# Altium project DM3390_R0M0E0.PrjPcb (part 1 of 5)
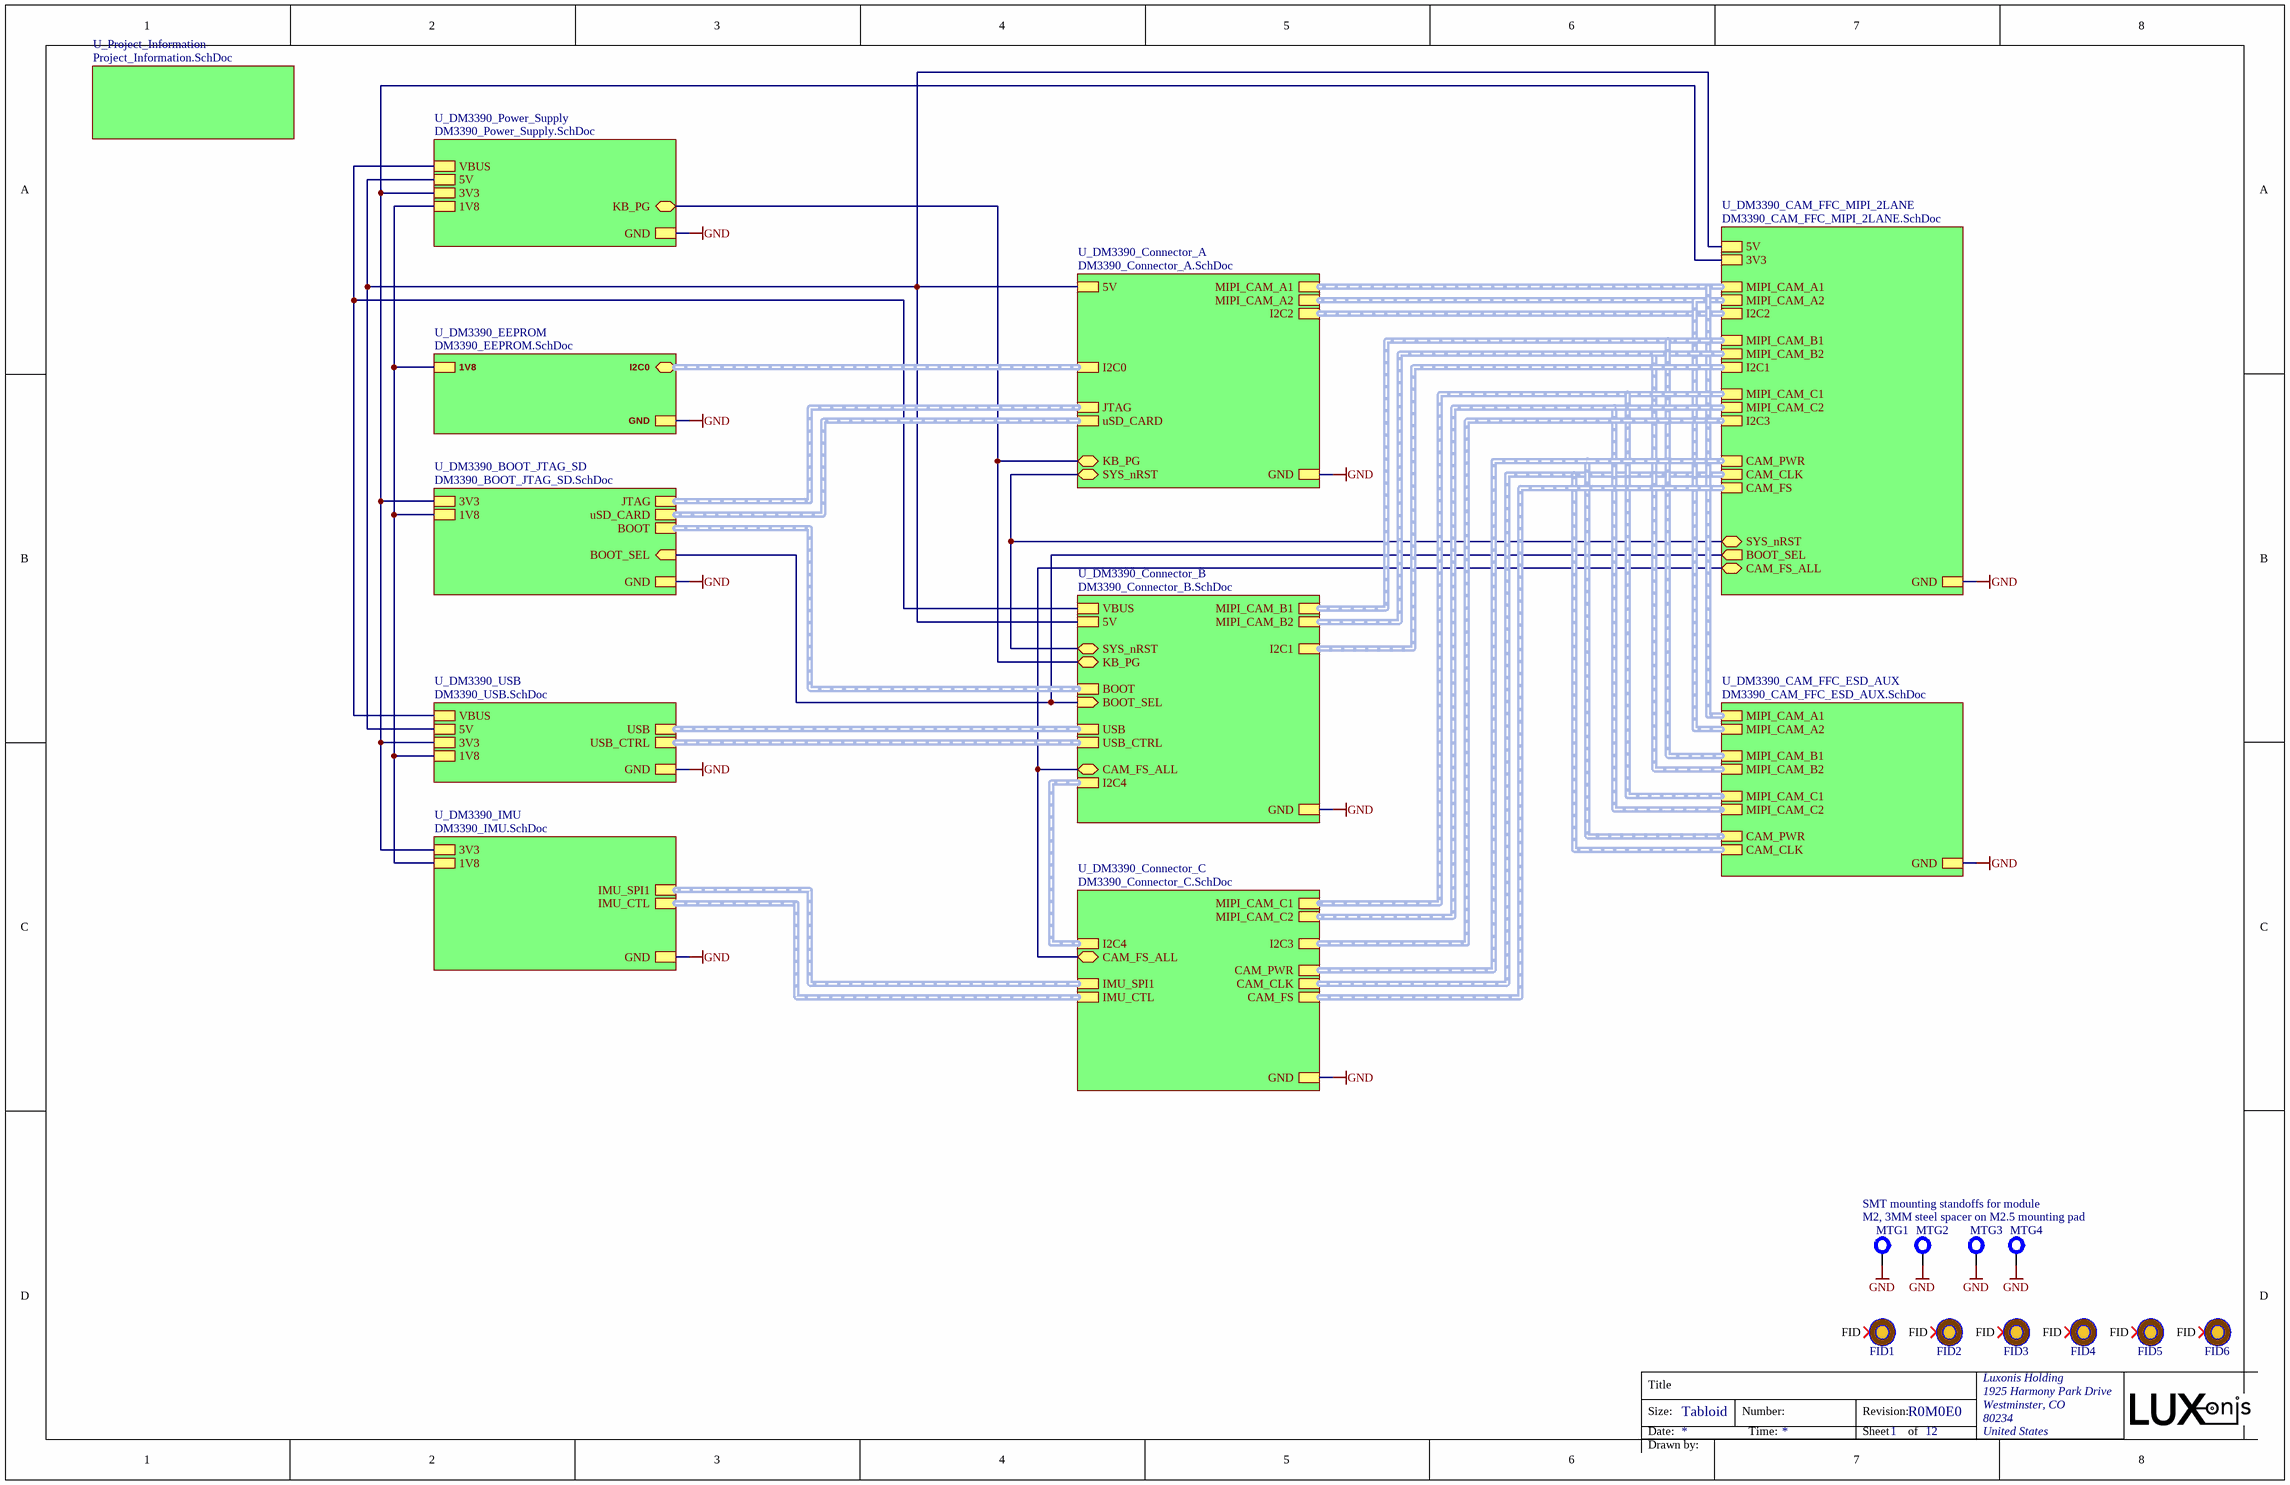
[diagram p0: DM3390_TopLevel.SchDoc]
document_number: D0000190; drawn_by: David Malovrh; project_title: DM3390; rev: R0M0E0
12 sheets, 186 parts. Net scope: strictly hierarchical (ports join the sheet entries above them; power ports are local).
Board file: DM3390.PcbDoc
Sheets:
  DM3390_TopLevel.SchDoc
    U_DM3390_USB = DM3390_USB.SchDoc
    U_Project_Information = Project_Information.SchDoc
    U_DM3390_Power_Supply = DM3390_Power_Supply.SchDoc
    U_DM3390_IMU = DM3390_IMU.SchDoc
    U_DM3390_BOOT_JTAG_SD = DM3390_BOOT_JTAG_SD.SchDoc
    U_DM3390_CAM_FFC_ESD_AUX = DM3390_CAM_FFC_ESD_AUX.SchDoc
    U_DM3390_CAM_FFC_MIPI_2LANE = DM3390_CAM_FFC_MIPI_2LANE.SchDoc
    U_DM3390_Connector_A = DM3390_Connector_A.SchDoc
    U_DM3390_Connector_B = DM3390_Connector_B.SchDoc
    U_DM3390_EEPROM = DM3390_EEPROM.SchDoc
    U_DM3390_Connector_C = DM3390_Connector_C.SchDoc

## Sheet DM3390_TopLevel.SchDoc: =project_title
size Tabloid; PageSetup: Record=PageOptions|CenterHorizontal=True|CenterVertical=True|PrintScale=0.73|XCorrection=1.00|YCorrection=1.00|PrintKind=0|BorderSize=5000000|LeftOffset=0|BottomOffset=0|Orientation=2|PaperLength=1000|PaperWidth=1000|Scale=100|PaperSource=7|PrintQuality=-4|MediaType=1|DitherType=10|PaperKind=A4|PrintScaleMode=1; CompanyName: Luxonis Holding; DrawnBy: David Malovrh; Organization: Luxonis Holding; Address1: 1925 Harmony Park Drive; Address2: Westminster, CO; Address3: 80234; Address4: United States; DocumentNumber: D0000190; SheetNumber: 1; SheetTotal: 12

### Parts
FID1  FIDUCIAL_ROUND_1MM  [FIDUCIAL_ROUND_1MM]  (value not drawn)  (no BOM)
FID2  FIDUCIAL_ROUND_1MM  [FIDUCIAL_ROUND_1MM]  (value not drawn)  (no BOM)
FID3  FIDUCIAL_ROUND_1MM  [FIDUCIAL_ROUND_1MM]  (value not drawn)  (no BOM)
FID4  FIDUCIAL_ROUND_1MM  [FIDUCIAL_ROUND_1MM]  (value not drawn)  (no BOM)
FID5  FIDUCIAL_ROUND_1MM  [FIDUCIAL_ROUND_1MM]  (value not drawn)  (no BOM)
FID6  FIDUCIAL_ROUND_1MM  [FIDUCIAL_ROUND_1MM]  (value not drawn)  (no BOM)
MTG1  M2, 3MM steel spacer on M2.5 mounting pad  [9774030243R]
MTG2  M2, 3MM steel spacer on M2.5 mounting pad  [9774030243R]  (value not drawn)
MTG3  M2, 3MM steel spacer on M2.5 mounting pad  [9774030243R]  (value not drawn)
MTG4  M2, 3MM steel spacer on M2.5 mounting pad  [9774030243R]  (value not drawn)

### Sub-sheets
U_DM3390_BOOT_JTAG_SD = DM3390_BOOT_JTAG_SD.SchDoc: 1V8, GND, 3V3, JTAG (harness JTAG), BOOT (harness BOOT), uSD_CARD (harness uSD_CARD), BOOT_SEL (in)
U_DM3390_CAM_FFC_ESD_AUX = DM3390_CAM_FFC_ESD_AUX.SchDoc: MIPI_CAM_C1 (harness MIPI_CAM_C1), MIPI_CAM_C2 (harness MIPI_CAM_C2), MIPI_CAM_B1 (harness MIPI_CAM_B1), MIPI_CAM_A1 (harness MIPI_CAM_A1), MIPI_CAM_A2 (harness MIPI_CAM_A2), CAM_PWR (harness CAM_PWR), MIPI_CAM_B2 (harness MIPI_CAM_B2), CAM_CLK (harness CAM_CLK), GND
U_DM3390_CAM_FFC_MIPI_2LANE = DM3390_CAM_FFC_MIPI_2LANE.SchDoc: I2C1 (harness I2C1), GND, 3V3, CAM_FS_ALL (bidir), MIPI_CAM_C1 (harness MIPI_CAM_C1), MIPI_CAM_C2 (harness MIPI_CAM_C2), I2C3 (harness I2C3), MIPI_CAM_B2 (harness MIPI_CAM_B2), MIPI_CAM_B1 (harness MIPI_CAM_B1), CAM_CLK (harness CAM_CLK), CAM_PWR (harness CAM_PWR), MIPI_CAM_A2 (harness MIPI_CAM_A2), MIPI_CAM_A1 (harness MIPI_CAM_A1), I2C2 (harness I2C2), CAM_FS (harness CAM_FS), SYS_nRST (bidir), BOOT_SEL (out), 5V
U_DM3390_Connector_A = DM3390_Connector_A.SchDoc: 5V, GND, MIPI_CAM_A1 (harness MIPI_CAM_A1), MIPI_CAM_A2 (harness MIPI_CAM_A2), I2C0 (harness I2C0), JTAG (harness JTAG), I2C2 (harness I2C2), KB_PG (bidir), uSD_CARD (harness uSD_CARD), SYS_nRST (bidir)
U_DM3390_Connector_B = DM3390_Connector_B.SchDoc: MIPI_CAM_B2 (harness MIPI_CAM_B2), GND, MIPI_CAM_B1 (harness MIPI_CAM_B1), USB (harness USB), I2C4 (harness I2C4), CAM_FS_ALL (bidir), I2C1 (harness I2C1), BOOT_SEL (in), KB_PG (bidir), USB_CTRL (harness USB_CTRL), SYS_nRST (bidir), BOOT, VBUS, 5V
U_DM3390_Connector_C = DM3390_Connector_C.SchDoc: MIPI_CAM_C1 (harness MIPI_CAM_C1), GND, MIPI_CAM_C2 (harness MIPI_CAM_C2), I2C4 (harness I2C4), IMU_SPI1 (harness IMU_SPI1), CAM_PWR (harness CAM_PWR), CAM_CLK (harness CAM_CLK), CAM_FS (harness CAM_FS), CAM_FS_ALL (bidir), IMU_CTL (harness IMU_CTL), I2C3 (harness I2C3)
U_DM3390_EEPROM = DM3390_EEPROM.SchDoc: 1V8, GND, I2C0 (bidir, harness I2C0)
U_DM3390_IMU = DM3390_IMU.SchDoc: GND, 3V3, 1V8, IMU_SPI1 (harness IMU_SPI1), IMU_CTL (harness IMU_CTL)
U_DM3390_Power_Supply = DM3390_Power_Supply.SchDoc: GND, 1V8, 5V, VBUS, 3V3, KB_PG (bidir)
U_DM3390_USB = DM3390_USB.SchDoc: VBUS, GND, 3V3, 5V, USB (harness USB), USB_CTRL (harness USB_CTRL), 1V8
U_Project_Information = Project_Information.SchDoc: no entries

### Nets
1V8: sheet U_DM3390_USB/1V8, sheet U_DM3390_Power_Supply/1V8, sheet U_DM3390_IMU/1V8, sheet U_DM3390_BOOT_JTAG_SD/1V8, sheet U_DM3390_EEPROM/1V8
3V3: sheet U_DM3390_USB/3V3, sheet U_DM3390_Power_Supply/3V3, sheet U_DM3390_IMU/3V3, sheet U_DM3390_BOOT_JTAG_SD/3V3, sheet U_DM3390_CAM_FFC_MIPI_2LANE/3V3
5V: sheet U_DM3390_USB/5V, sheet U_DM3390_Power_Supply/5V, sheet U_DM3390_CAM_FFC_MIPI_2LANE/5V, sheet U_DM3390_Connector_A/5V, sheet U_DM3390_Connector_B/5V
GND: MTG1.1 MTG2.1 MTG3.1 MTG4.1 ; sheet U_DM3390_USB/GND, sheet U_DM3390_Power_Supply/GND, sheet U_DM3390_IMU/GND, sheet U_DM3390_BOOT_JTAG_SD/GND, sheet U_DM3390_CAM_FFC_ESD_AUX/GND, sheet U_DM3390_CAM_FFC_MIPI_2LANE/GND, sheet U_DM3390_Connector_A/GND, sheet U_DM3390_Connector_B/GND, sheet U_DM3390_EEPROM/GND, sheet U_DM3390_Connector_C/GND
VBUS: sheet U_DM3390_USB/VBUS, sheet U_DM3390_Power_Supply/VBUS, sheet U_DM3390_Connector_B/VBUS
BOOT_SEL: sheet U_DM3390_BOOT_JTAG_SD/BOOT_SEL, sheet U_DM3390_CAM_FFC_MIPI_2LANE/BOOT_SEL, sheet U_DM3390_Connector_B/BOOT_SEL
CAM_FS_ALL: sheet U_DM3390_CAM_FFC_MIPI_2LANE/CAM_FS_ALL, sheet U_DM3390_Connector_B/CAM_FS_ALL, sheet U_DM3390_Connector_C/CAM_FS_ALL
KB_PG: sheet U_DM3390_Power_Supply/KB_PG, sheet U_DM3390_Connector_A/KB_PG, sheet U_DM3390_Connector_B/KB_PG
SYS_nRST: sheet U_DM3390_CAM_FFC_MIPI_2LANE/SYS_nRST, sheet U_DM3390_Connector_A/SYS_nRST, sheet U_DM3390_Connector_B/SYS_nRST

Not connected (* = marked no-connect by the designer): FID1 FID*; FID2 FID*; FID3 FID*; FID4 FID*; FID5 FID*; FID6 FID*

### Buses and harness runs
harness sheet U_DM3390_BOOT_JTAG_SD/BOOT = sheet U_DM3390_Connector_B/BOOT
harness sheet U_DM3390_BOOT_JTAG_SD/JTAG = sheet U_DM3390_Connector_A/JTAG
harness sheet U_DM3390_BOOT_JTAG_SD/uSD_CARD = sheet U_DM3390_Connector_A/uSD_CARD
harness sheet U_DM3390_CAM_FFC_ESD_AUX/CAM_CLK = sheet U_DM3390_CAM_FFC_MIPI_2LANE/CAM_CLK = sheet U_DM3390_Connector_C/CAM_CLK
harness sheet U_DM3390_CAM_FFC_ESD_AUX/CAM_PWR = sheet U_DM3390_CAM_FFC_MIPI_2LANE/CAM_PWR = sheet U_DM3390_Connector_C/CAM_PWR
harness sheet U_DM3390_CAM_FFC_ESD_AUX/MIPI_CAM_A1 = sheet U_DM3390_CAM_FFC_MIPI_2LANE/MIPI_CAM_A1 = sheet U_DM3390_Connector_A/MIPI_CAM_A1
harness sheet U_DM3390_CAM_FFC_ESD_AUX/MIPI_CAM_A2 = sheet U_DM3390_CAM_FFC_MIPI_2LANE/MIPI_CAM_A2 = sheet U_DM3390_Connector_A/MIPI_CAM_A2
harness sheet U_DM3390_CAM_FFC_ESD_AUX/MIPI_CAM_B1 = sheet U_DM3390_CAM_FFC_MIPI_2LANE/MIPI_CAM_B1 = sheet U_DM3390_Connector_B/MIPI_CAM_B1
harness sheet U_DM3390_CAM_FFC_ESD_AUX/MIPI_CAM_B2 = sheet U_DM3390_CAM_FFC_MIPI_2LANE/MIPI_CAM_B2 = sheet U_DM3390_Connector_B/MIPI_CAM_B2
harness sheet U_DM3390_CAM_FFC_ESD_AUX/MIPI_CAM_C1 = sheet U_DM3390_CAM_FFC_MIPI_2LANE/MIPI_CAM_C1 = sheet U_DM3390_Connector_C/MIPI_CAM_C1
harness sheet U_DM3390_CAM_FFC_ESD_AUX/MIPI_CAM_C2 = sheet U_DM3390_CAM_FFC_MIPI_2LANE/MIPI_CAM_C2 = sheet U_DM3390_Connector_C/MIPI_CAM_C2
harness sheet U_DM3390_CAM_FFC_MIPI_2LANE/CAM_FS = sheet U_DM3390_Connector_C/CAM_FS
harness sheet U_DM3390_CAM_FFC_MIPI_2LANE/I2C1 = sheet U_DM3390_Connector_B/I2C1
harness sheet U_DM3390_CAM_FFC_MIPI_2LANE/I2C2 = sheet U_DM3390_Connector_A/I2C2
harness sheet U_DM3390_CAM_FFC_MIPI_2LANE/I2C3 = sheet U_DM3390_Connector_C/I2C3
harness sheet U_DM3390_Connector_A/I2C0 = sheet U_DM3390_EEPROM/I2C0
harness sheet U_DM3390_Connector_B/I2C4 = sheet U_DM3390_Connector_C/I2C4
harness sheet U_DM3390_Connector_B/USB = sheet U_DM3390_USB/USB
harness sheet U_DM3390_Connector_B/USB_CTRL = sheet U_DM3390_USB/USB_CTRL
harness sheet U_DM3390_Connector_C/IMU_CTL = sheet U_DM3390_IMU/IMU_CTL
harness sheet U_DM3390_Connector_C/IMU_SPI1 = sheet U_DM3390_IMU/IMU_SPI1

### Notes on the sheet
- SMT mounting standoffs for module
- Title
- Size:
- Date:
- Tabloid
- Number:
- Time:
- Revision:
- Sheet
- of
- Drawn by:

### Library data of the parts
FID1-FID6 = FIDUCIAL: Fiducial with various available footprints
MTG1-MTG4 = 9774030243R: MP ROUND STANDOFF M2X0.4 STEEL 3MM; Manufacturer 1: Wurth Electronics; Plating: Tin; Threaded/Unthreaded: Threaded; Outside Diameter: 0.171inch; Supplier 1: Digi-Key; Manufacturer Part Number 1: 9774030243R; Stock 1: 20568; Pricing 1: 1=0.95000, 10=0.91800, 50=0.79500, 100=0.73900 (USD); RoHS: Yes; Material: Steel; Length: 0.173inch; REACH SVHC: Unknown; ComponentLink1URL: http://www.mouser.com/ds/2/445/9774030243R-611455.pdf?src-supplier=Mouser; ComponentLink1Description: http://www.mouser.com/ds/2/445/9774030243R-611455.pdf?src-supplier=Mouser; ComponentLink2URL: http://www.farnell.com/datasheets/1960368.pdf?src-supplier=Farnell; ComponentLink2Description: http://www.farnell.com/datasheets/1960368.pdf?src-supplier=Farnell; ComponentLink3URL: https://katalog.we-online.de/em/datasheet/9774030243R.pdf?src-supplier=Digi-Key; ComponentLink3Description: https://katalog.we-online.de/em/datasheet/9774030243R.pdf?src-supplier=Digi-Key; ComponentLink4URL: http://www.farnell.com/datasheets/1960368.pdf?src-supplier=Newark; ComponentLink4Description: http://www.farnell.com/datasheets/1960368.pdf?src-supplier=Newark; ComponentLink5URL: http://www.farnell.com/datasheets/1960368.pdf?src-supplier=Element14; ComponentLink5Description: http://www.farnell.com/datasheets/1960368.pdf?src-supplier=Element14; Supplier Part Number 1: 732-7085-1-ND; Supplier 2: Mouser; Supplier Part Number 2: 710-9774030243R; Supplier 3: Element14; Supplier Part Number 3: 2497599

## Sheet DM3390_USB.SchDoc: =project_title
size Tabloid; PageSetup: Record=PageOptions|CenterHorizontal=True|CenterVertical=True|PrintScale=0.73|XCorrection=1.00|YCorrection=1.00|PrintKind=0|BorderSize=5000000|LeftOffset=0|BottomOffset=0|Orientation=2|PaperLength=1000|PaperWidth=1000|Scale=100|PaperSource=7|PrintQuality=-4|MediaType=1|DitherType=10|PaperKind=A4|PrintScaleMode=1; CompanyName: Luxonis Holding; DrawnBy: David Malovrh; Organization: Luxonis Holding; Address1: 1925 Harmony Park Drive; Address2: Westminster, CO; Address3: 80234; Address4: United States; DocumentNumber: D0000190; SheetNumber: 12; SheetTotal: 12
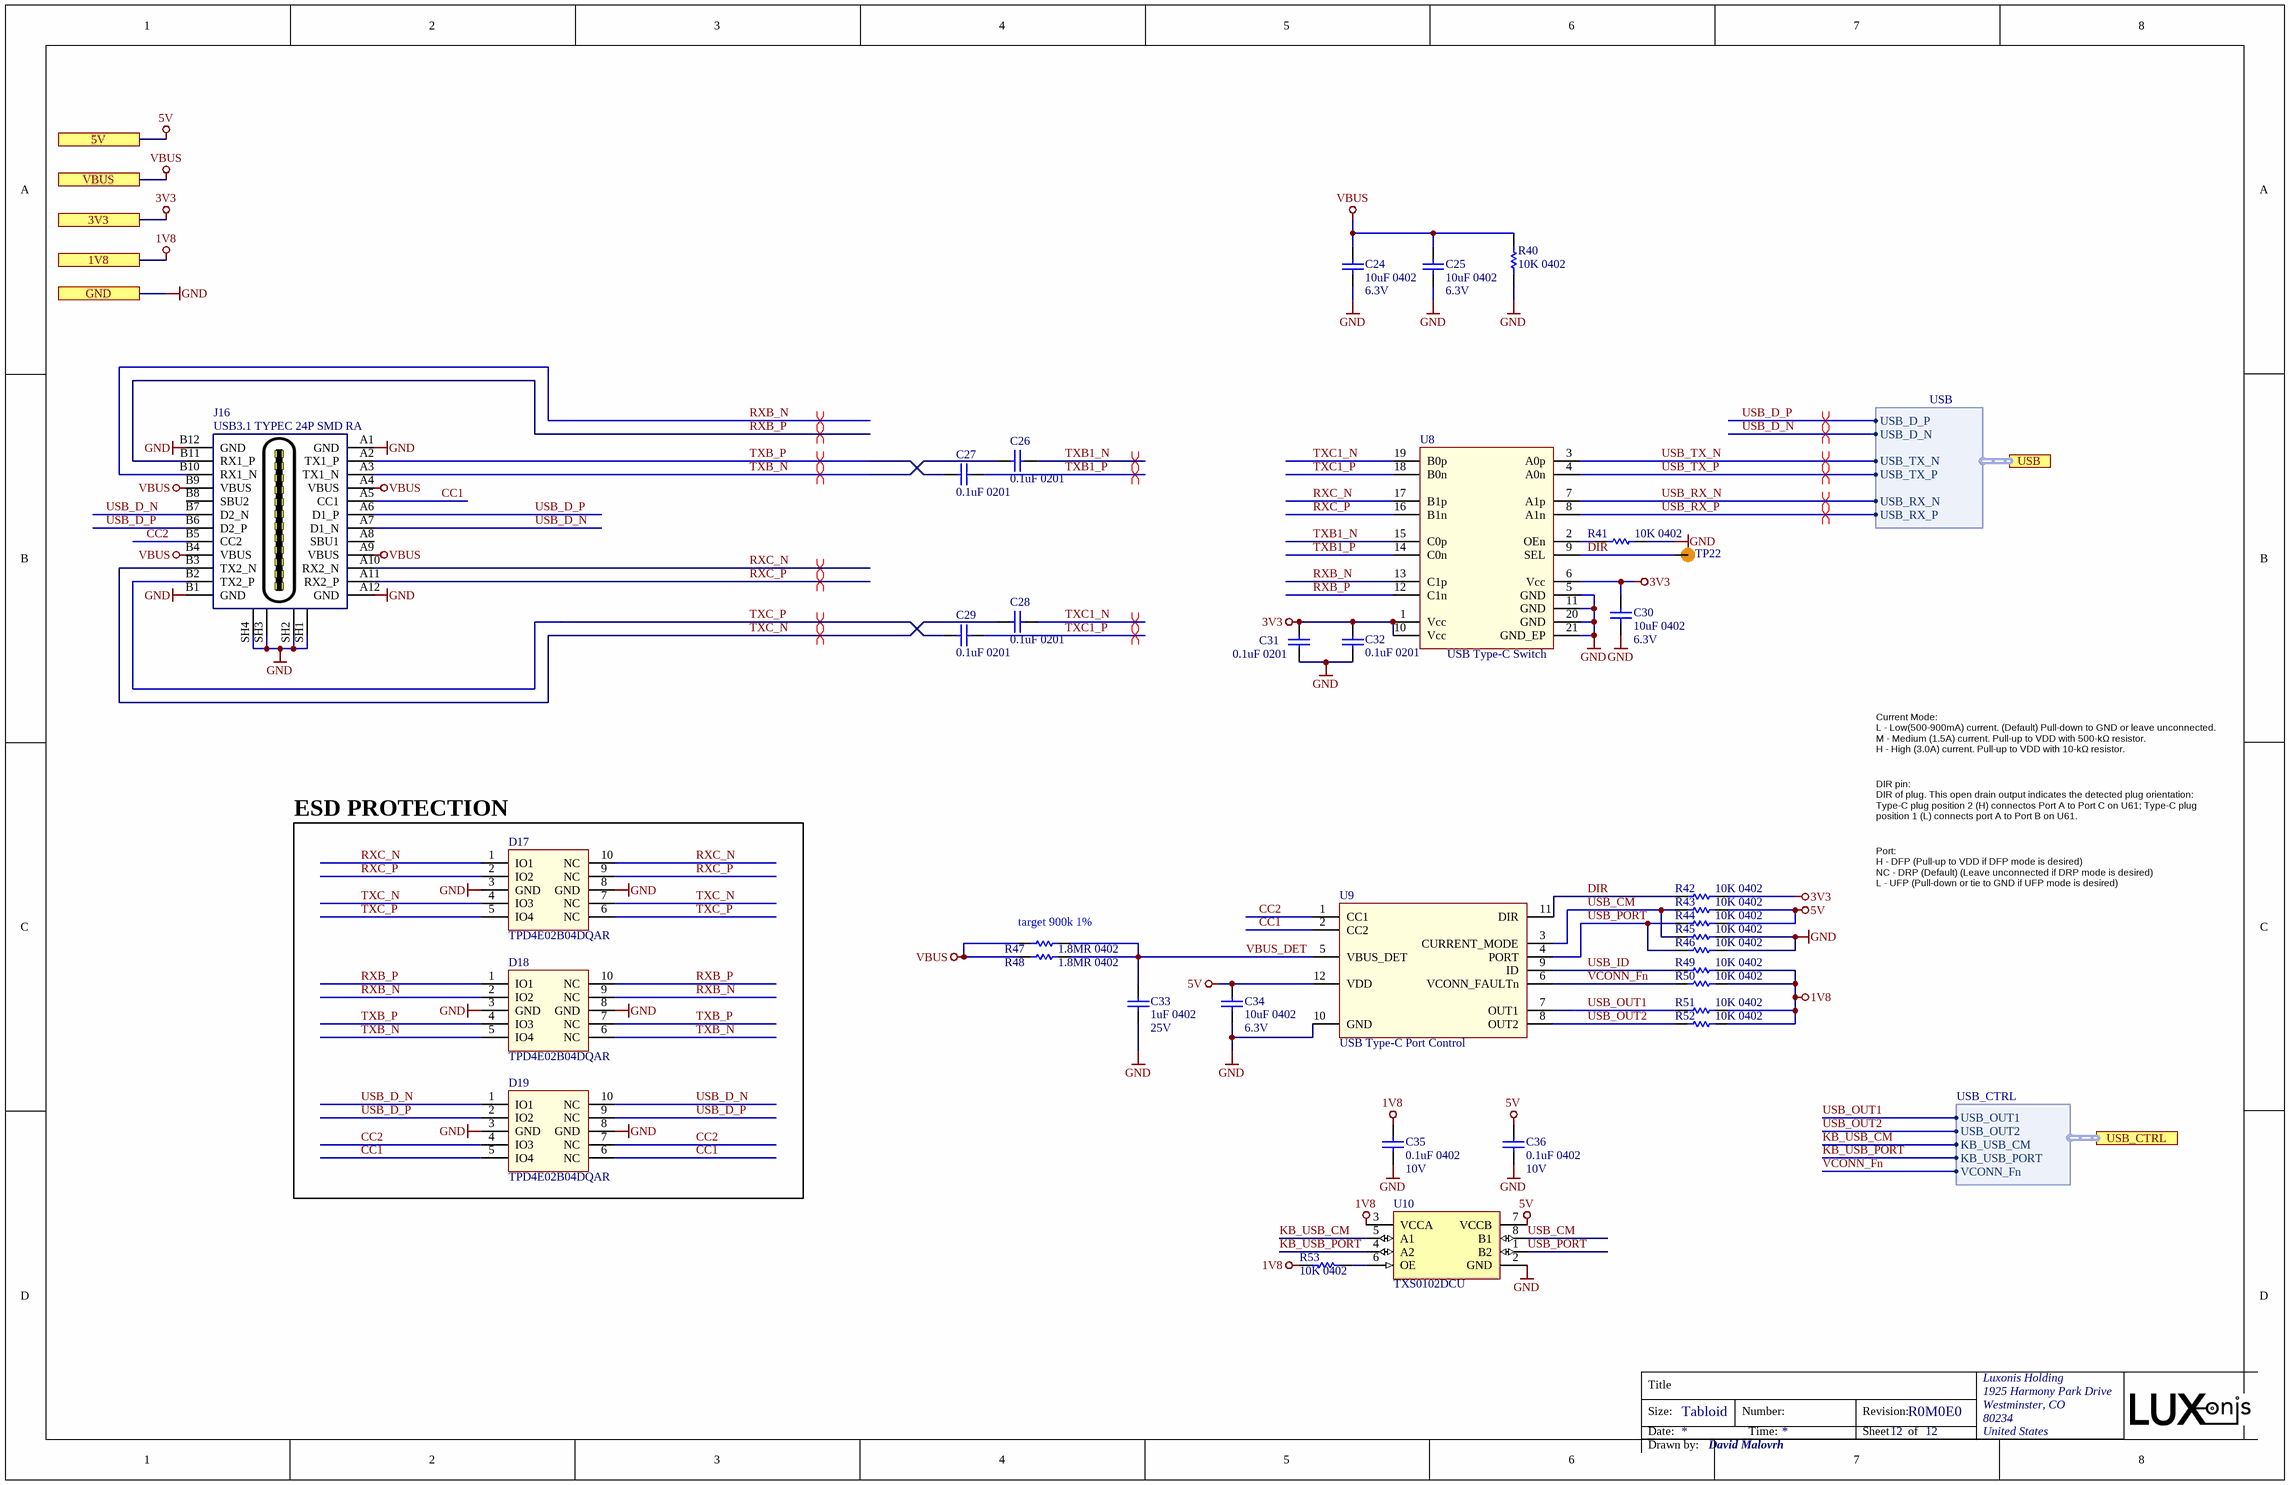
[diagram p1: DM3390_USB.SchDoc]

### Parts
C24  10uF 0402  Voltage Rating: 6.3V  [CAPC0402(1005)70_N]
C25  10uF 0402  Voltage Rating: 6.3V  [CAPC0402(1005)70_N]
C26  0.1uF 0201  [CAPC0201(0603)33_L]
C27  0.1uF 0201  [CAPC0201(0603)33_L]
C28  0.1uF 0201  [CAPC0201(0603)33_L]
C29  0.1uF 0201  [CAPC0201(0603)33_L]
C30  10uF 0402  Voltage Rating: 6.3V  [CAPC0402(1005)70_N]
C31  0.1uF 0201  [CAPC0201(0603)33_L]
C32  0.1uF 0201  [CAPC0201(0603)33_L]
C33  1uF 0402  Voltage Rating: 25V  [CAPC0402(1005)70_L]
C34  10uF 0402  Voltage Rating: 6.3V  [CAPC0402(1005)70_L]
C35  0.1uF 0402  Voltage Rating: 10V  [CAPC0402(1005)70_L]
C36  0.1uF 0402  Voltage Rating: 10V  [CAPC0402(1005)70_L]
D17  TPD4E02B04DQAR  [TPD4E02B04DQAR]
D18  TPD4E02B04DQAR  [TPD4E02B04DQAR]
D19  TPD4E02B04DQAR  [TPD4E02B04DQAR]
J16  USB3.1 TYPEC 24P SMD RA  [105450-0101]
R40  10K 0402  [RESC0402(1005)_N]
R41  10K 0402  [RESC0402(1005)_N]
R42  10K 0402  [RESC0402(1005)_L]
R43  10K 0402  [RESC0402(1005)_L]
R44  10K 0402  [RESC0402(1005)_L]
R45  10K 0402  [RESC0402(1005)_L]
R46  10K 0402  [RESC0402(1005)_L]
R47  1.8MR 0402  [RESC0402(1005)_L]
R48  1.8MR 0402  [RESC0402(1005)_L]
R49  10K 0402  [RESC0402(1005)_L]
R50  10K 0402  [RESC0402(1005)_L]
R51  10K 0402  [RESC0402(1005)_L]
R52  10K 0402  [RESC0402(1005)_L]
R53  10K 0402  [RESC0402(1005)_N]
TP22  TP100_200_NS  [TP100_200_NS]  (value not drawn)  (no BOM)
U8  USB Type-C Switch  [CBTL02043A]
U9  USB Type-C Port Control  [TUSB321RWBR]
U10  TXS0102DCU  [TXS0102DCUR]

### Blocks framed on the sheet
ESD PROTECTION: D17-D19

### Ports
1V8, 3V3, 5V, GND, USB (harness USB), USB_CTRL (harness USB_CTRL), VBUS

### Harnesses
USB: USB_D_P, USB_D_N, USB_TX_N, USB_TX_P, USB_RX_N, USB_RX_P
USB_CTRL: USB_OUT1, USB_OUT2, KB_USB_CM, KB_USB_PORT, VCONN_Fn

### Nets
1V8: C35.2 R49.2 R50.2 R51.2 R52.2 R53.2 U10.3(VCCA) ; port 1V8
3V3: C30.2 C31.2 C32.2 R42.2 U8.1(Vcc) U8.6(Vcc) U8.10(Vcc) ; port 3V3
5V: C34.2 C36.2 R43.2 R44.2 U9.12(VDD) U10.7(VCCB) ; port 5V
GND: C24.1 C25.1 C30.1 C31.1 C32.1 C33.1 C34.1 C35.1 C36.1 D17.3(GND) D17.8(GND) D18.3(GND) D18.8(GND) D19.3(GND) D19.8(GND) J16.A1(GND) J16.A12(GND) J16.B1(GND) J16.B12(GND) J16.SH1(SH) J16.SH2(SH) J16.SH3(SH) J16.SH4(SH) R40.1 R41.2 R45.2 R46.2 U8.5(GND) U8.11(GND) U8.20(GND) U8.21(GND_EP) U9.10(GND) U10.2(GND) ; port GND
VBUS: C24.2 C25.2 J16.A4(VBUS) J16.A9(VBUS) J16.B4(VBUS) J16.B9(VBUS) R40.2 R47.1 R48.1 ; port VBUS
CC1: D19.5(IO4) D19.6(NC) J16.A5(CC1) U9.2(CC2)
CC2: D19.4(IO3) D19.7(NC) J16.B5(CC2) U9.1(CC1)
DIR: R42.1 TP22.1 U8.9(SEL) U9.11(DIR)
KB_USB_CM: U10.5(A1) ; port USB_CTRL.KB_USB_CM
KB_USB_PORT: U10.4(A2) ; port USB_CTRL.KB_USB_PORT
RXB_N: D18.2(IO2) D18.9(NC) J16.B10(RX1_N) U8.13(C1p)
RXB_P: D18.1(IO1) D18.10(NC) J16.B11(RX1_P) U8.12(C1n)
RXC_N: D17.1(IO1) D17.10(NC) J16.A10(RX2_N) U8.17(B1p)
RXC_P: D17.2(IO2) D17.9(NC) J16.A11(RX2_P) U8.16(B1n)
TXB1_N: C26.2 U8.15(C0p)
TXB1_P: C27.2 U8.14(C0n)
TXB_N: C26.1 D18.5(IO4) D18.6(NC) J16.A3(TX1_N)
TXB_P: C27.1 D18.4(IO3) D18.7(NC) J16.A2(TX1_P)
TXC1_N: C28.2 U8.19(B0p)
TXC1_P: C29.2 U8.18(B0n)
TXC_N: C28.1 D17.4(IO3) D17.7(NC) J16.B3(TX2_N)
TXC_P: C29.1 D17.5(IO4) D17.6(NC) J16.B2(TX2_P)
USB_CM: R43.1 R45.1 U9.3(CURRENT_MODE) U10.8(B1)
USB_D_N: D19.1(IO1) D19.10(NC) J16.A7(D1_N) J16.B7(D2_N) ; port USB.USB_D_N
USB_D_P: D19.2(IO2) D19.9(NC) J16.A6(D1_P) J16.B6(D2_P) ; port USB.USB_D_P
USB_ID: R49.1 U9.9(ID)
USB_OUT1: R51.1 U9.7(OUT1) ; port USB_CTRL.USB_OUT1
USB_OUT2: R52.1 U9.8(OUT2) ; port USB_CTRL.USB_OUT2
USB_PORT: R44.1 R46.1 U9.4(PORT) U10.1(B2)
USB_RX_N: U8.7(A1p) ; port USB.USB_RX_N
USB_RX_P: U8.8(A1n) ; port USB.USB_RX_P
USB_TX_N: U8.3(A0p) ; port USB.USB_TX_N
USB_TX_P: U8.4(A0n) ; port USB.USB_TX_P
VBUS_DET: C33.2 R47.2 R48.2 U9.5(VBUS_DET)
VCONN_Fn: R50.1 U9.6(VCONN_FAULTn) ; port USB_CTRL.VCONN_Fn
NetR41_1: R41.1 U8.2(OEn)
NetR53_1: R53.1 U10.6(OE)

Not connected (* = marked no-connect by the designer): J16 A8(SBU1) B8(SBU2)

### Layout directives
differential pair; differential pair class USB3: RXB_N, RXB_P, RXC_N, RXC_P, TXB1_N, TXB1_P, TXB_N, TXB_P, TXC1_N, TXC1_P, TXC_N, TXC_P, USB_D_N, USB_D_P, USB_RX_N, USB_RX_P, USB_TX_N, USB_TX_P

### Notes on the sheet
- Current Mode:
  L - Low(500-900mA) current. (Default) Pull-down to GND or leave unconnected.
  M - Medium (1.5A) current. Pull-up to VDD with 500-kΩ resistor.
  H - High (3.0A) current. Pull-up to VDD with 10-kΩ resistor.
- DIR pin:
  DIR of plug. This open drain output indicates the detected plug orientation: Type-C plug position 2 (H) connectos Port A to Port C on U61; Type-C plug position 1 (L) connects port A to Port B on U61.
- Port:
  H - DFP (Pull-up to VDD if DFP mode is desired)
  NC - DRP (Default) (Leave unconnected if DRP mode is desired)
  L - UFP (Pull-down or tie to GND if UFP mode is desired)
- (near R47) target 900k 1%
- Title
- Size:
- Date:
- Tabloid
- Number:
- Time:
- Revision:
- Sheet
- of
- Drawn by:

### Library data of the parts
C24 C25 C30 C34 = GRM155R60J106ME15D: CAP CER 10UF 6.3V X5R 0402 20%; Manufacturer 1: Murata; Supplier 1: Digi-Key; Manufacturer Part Number 1: GRM155R60J106ME15D; Stock 1: 1839627; Pricing 1: 1=0.23000, 10=0.15700, 100=0.07950, 500=0.05442, 1000=0.04814, 2500=0.04605, 5000=0.04186 (USD); RoHS: Yes; Mount: Surface Mount; Case/Package: 0402; Case Code (Metric): 1005; Case Code (Imperial): 0402; Min Operating Temperature: -55°C; Max Operating Temperature: 85°C; Packaging: Tape and Reel; Capacitance: 10uF; Dielectric: X5R; Length: 0.039inch; Width: 0.02inch; ComponentLink1URL: https://www.murata.com/~/media/webrenewal/support/library/catalog/products/capacitor/mlcc/c02e.ashx?la=en-us&src-supplier=Digi-Key; ComponentLink1Description: https://www.murata.com/~/media/webrenewal/support/library/catalog/products/capacitor/mlcc/c02e.ashx?la=en-us&src-supplier=Digi-Key; Supplier Part Number 1: 490-13238-1-ND; Voltage Rating (DC): 6.3V; Thickness: 0.026inch; Tolerance: 20%
C26-C29 C31 C32 = GRM033R61A104KE15D: CAP CER 0.1UF 10V X5R 0201; Manufacturer 1: Murata; Capacitance: 100nF; Tolerance: 10%; Supplier 1: Digi-Key; Manufacturer Part Number 1: GRM033R61A104KE15D; Stock 1: 45335312; Pricing 1: 1=0.10000, 10=0.04200, 100=0.01860, 500=0.01330, 1000=0.01045, 2500=0.00950, 5000=0.00874 (USD); RoHS: Yes; Mount: Surface Mount; Case/Package: 0201; Weight: 6E-06oz; Case Code (Metric): 0603; Case Code (Imperial): 0201; Min Operating Temperature: -55°C; Max Operating Temperature: 85°C; Packaging: Tape and Reel; Voltage Rating: 10V; Package Quantity: 1; Voltage Rating (DC): 10V; Dielectric: X5R; Termination: SMD/SMT; Length: 0.6mm; Height: 0.3mm; Width: 0.012inch; Thickness: 0.013inch; Depth: 0.3mm; Radiation Hardening: No; Lead Free: Lead Free; REACH SVHC: No SVHC; ComponentLink1URL: https://datasheet.ciiva.com/26843/getdatasheetpartid-308656-26843739.pdf?src-supplier=Verical; ComponentLink1Description: https://datasheet.ciiva.com/26843/getdatasheetpartid-308656-26843739.pdf?src-supplier=Verical; ComponentLink2URL: https://datasheet.ciiva.com/5413/product-5413117.pdf?src-supplier=Mouser; ComponentLink2Description: https://datasheet.ciiva.com/5413/product-5413117.pdf?src-supplier=Mouser; ComponentLink3URL: https://datasheet.ciiva.com/6256/partnumbering-e-01-6256406.pdf?src-supplier=Digi-Key; ComponentLink3Description: https://datasheet.ciiva.com/6256/partnumbering-e-01-6256406.pdf?src-supplier=Digi-Key; ComponentLink4URL: https://datasheet.ciiva.com/6256/partnumbering-e-01-6256407.pdf?src-supplier=Digi-Key; ComponentLink4Description: https://datasheet.ciiva.com/6256/partnumbering-e-01-6256407.pdf?src-supplier=Digi-Key; ComponentLink5URL: https://datasheet.ciiva.com/6256/partnumbering-e-01-6256408.pdf?src-supplier=Digi-Key; ComponentLink5Description: https://datasheet.ciiva.com/6256/partnumbering-e-01-6256408.pdf?src-supplier=Digi-Key; Supplier Part Number 1: 490-5881-1-ND; Voltage: 10V
C33 = GRM155R61E105KA12D: CAP CER 1UF 25V X5R 0402 10%; Manufacturer 1: Murata; Material: Ceramic; Supplier 1: Digi-Key; Manufacturer Part Number 1: GRM155R61E105KA12D; Stock 1: 200653; Pricing 1: 1=0.10000, 10=0.07100, 100=0.03350, 500=0.02352, 1000=0.01947, 2500=0.01812, 5000=0.01658 (USD); RoHS: Yes; Mount: Surface Mount; Case/Package: 0402; Weight: 0.000212oz; Case Code (Metric): 1005; Case Code (Imperial): 0402; Min Operating Temperature: -55°C; Max Operating Temperature: 85°C; Tolerance: 10%; Capacitance: 1uF; Dielectric: X5R; Voltage Rating (DC): 25V; Packaging: Tape and Reel; Package Quantity: 10000; Termination: SMD/SMT; Voltage: 25V; Length: 1mm; Height: 0.5mm; Width: 0.5mm; Thickness: 0.022inch; Depth: 0.5mm; Lead Free: Lead Free; REACH SVHC: No SVHC; ComponentLink1URL: https://datasheet.ciiva.com/22732/1666664-22732122.pdf?src-supplier=Element14; ComponentLink1Description: https://datasheet.ciiva.com/22732/1666664-22732122.pdf?src-supplier=Element14; ComponentLink2URL: https://datasheet.ciiva.com/7719/1666664-7719006.pdf?src-supplier=Element14; ComponentLink2Description: https://datasheet.ciiva.com/7719/1666664-7719006.pdf?src-supplier=Element14; Supplier Part Number 1: 490-10017-1-ND; Supplier 2: Arrow; Supplier 3: TTI; Supplier Part Number 2: GRM155R61E105KA12D; Supplier Part Number 3: GRM155R61E105KA12D
C35 C36 = GRM155R71A104JA01D: CAP CER 0.1UF 10V X7R 0402 5%; Manufacturer 1: Murata; Capacitance: 100nF; Supplier 1: Digi-Key; Manufacturer Part Number 1: GRM155R71A104JA01D; Stock 1: 1346709; Pricing 1: 1=0.10000, 10=0.02500, 100=0.01130, 500=0.00806, 1000=0.00633, 2500=0.00575, 5000=0.00529 (USD); RoHS: Yes; Mount: Surface Mount; Case/Package: 0402; Case Code (Imperial): 0402; Case Code (Metric): 1005; Min Operating Temperature: -55°C; Max Operating Temperature: 125°C; Tolerance: 5%; Packaging: Tape and Reel; Voltage Rating (DC): 10V; Dielectric: X7R; Package Quantity: 10000; Termination: SMD/SMT; Length: 1mm; Height: 0.5mm; Width: 0.02inch; Thickness: 0.022inch; Depth: 0.5mm; Radiation Hardening: No; Lead Free: Lead Free; ComponentLink1URL: https://datasheet.ciiva.com/5411/product-5411135.pdf?src-supplier=Mouser; ComponentLink1Description: https://datasheet.ciiva.com/5411/product-5411135.pdf?src-supplier=Mouser; ComponentLink2URL: https://datasheet.ciiva.com/11618/c02e-11618821.pdf?src-supplier=Avnet; ComponentLink2Description: https://datasheet.ciiva.com/11618/c02e-11618821.pdf?src-supplier=Avnet; Supplier Part Number 1: 490-10777-1-ND
D17-D19 = TPD4E02B04DQAR: TVS DIODE 3.6V 8.8V 10USON 8.8V (Typ) Clamp 5A (8/20µs) Ipp Tvs Diode Surface Mount 10-USON (2.5x1); Manufacturer 1: Texas Instruments; Number of Bidirectional Channels: 4; Min Breakdown Voltage: 5.5V; Peak Pulse Power: 17W; Power Line Protection: No; Interface: USB,HDMI; Supplier 1: Digi-Key; Manufacturer Part Number 1: TPD4E02B04DQAR; Stock 1: 25615; Pricing 1: 1=0.69000, 10=0.60800, 100=0.46650, 500=0.36874, 1000=0.29499 (USD); RoHS: Yes; Mount: Surface Mount; Number of Pins: 10; Min Operating Temperature: -40°C; Max Operating Temperature: 125°C; Packaging: Cut Tape; Reverse Standoff Voltage: 3.6V; Clamping Voltage: 8.8V; Operating Supply Voltage: 3.6V; Peak Pulse Current: 5A; Number of Channels: 4; Composition: Zener; REACH SVHC: No SVHC; Lead Free: Lead Free; ComponentLink1URL: http://www.ti.com/general/docs/lit/getliterature.tsp?genericPartNumber=TPD4E02B04&amp;&amp;fileType=pdf&src-supplier=Element14; ComponentLink1Description: http://www.ti.com/general/docs/lit/getliterature.tsp?genericPartNumber=TPD4E02B04&amp;&amp;fileType=pdf&src-supplier=Element14; ComponentLink2URL: http://www.ti.com/lit/ds/symlink/tpd4e02b04.pdf?src-supplier=Farnell; ComponentLink2Description: http://www.ti.com/lit/ds/symlink/tpd4e02b04.pdf?src-supplier=Farnell; ComponentLink3URL: http://www.ti.com/lit/ds/symlink/tpd4e02b04.pdf?src-supplier=Newark; ComponentLink3Description: http://www.ti.com/lit/ds/symlink/tpd4e02b04.pdf?src-supplier=Newark; ComponentLink4URL: http://www.ti.com/lit/ds/symlink/tpd4e02b04.pdf?src-supplier=Digi-Key; ComponentLink4Description: http://www.ti.com/lit/ds/symlink/tpd4e02b04.pdf?src-supplier=Digi-Key; Supplier Part Number 1: 296-43875-1-ND
J16 = 105450-0101: CONN RCP USB3.1 TYPEC 24P SMD RA; Manufacturer 1: Molex; Connector Type: USB; Number of Contacts: 24; Gender: Receptacle; Number of Ports: 1; Current Rating: 5A; Mating Cycles: 10000; Shielding: Shielded; Pitch: 0.5mm; Supplier 1: Digi-Key; Manufacturer Part Number 1: 105450-0101; Stock 1: 13882; Pricing 1: 1=2.15000, 10=1.94900, 25=1.82960, 50=1.75000, 100=1.67050, 250=1.51140, 500=1.39208 (USD); RoHS: Yes; Mount: Surface Mount,Through Hole,Horizontal; Case/Package: 0101; Number of Pins: 24; Contact Material: Copper Alloy; Contact Plating: Gold; Number of Terminals: 24; Housing Material: Thermoplastic; Insulation Color: Black; Min Operating Temperature: -30°C; Max Operating Temperature: 85°C; Packaging: Tape and Reel; Orientation: Right Angle; Termination: Solder; USB Standard: USB 3.1; Features: Shielded; Length: 8.94mm; REACH SVHC: Unknown; Flammability Rating: UL94 V-0; ComponentLink1URL: http://www.farnell.com/datasheets/2673427.pdf?src-supplier=Farnell; ComponentLink1Description: http://www.farnell.com/datasheets/2673427.pdf?src-supplier=Farnell; ComponentLink2URL: http://www.farnell.com/datasheets/2801634.pdf?src-supplier=Farnell; ComponentLink2Description: http://www.farnell.com/datasheets/2801634.pdf?src-supplier=Farnell; ComponentLink3URL: http://www.farnell.com/datasheets/2672741.pdf?src-supplier=Newark; ComponentLink3Description: http://www.farnell.com/datasheets/2672741.pdf?src-supplier=Newark; ComponentLink4URL: https://www.molex.com/pdm_docs/sd/1054500101_sd.pdf?src-supplier=Digi-Key; ComponentLink4Description: https://www.molex.com/pdm_docs/sd/1054500101_sd.pdf?src-supplier=Digi-Key; ComponentLink5URL: https://www.molex.com/pdm_docs/ps/PS-105448-001.pdf?src-supplier=Digi-Key; ComponentLink5Description: https://www.molex.com/pdm_docs/ps/PS-105448-001.pdf?src-supplier=Digi-Key; ComponentLink6URL: http://www.farnell.com/datasheets/2015275.pdf?src-supplier=Element14; ComponentLink6Description: http://www.farnell.com/datasheets/2015275.pdf?src-supplier=Element14; ComponentLink7URL: http://www.literature.molex.com/SQLImages/kelmscott/Molex/PDF_Images/987651-4081.PDF?src-supplier=Avnet; ComponentLink7Description: http://www.literature.molex.com/SQLImages/kelmscott/Molex/PDF_Images/987651-4081.PDF?src-supplier=Avnet; ComponentLink8URL: http://www.literature.molex.com/SQLImages/kelmscott/Molex/PDF_Images/987651-4081.PDF?src-supplier=Avnet+Asia; ComponentLink8Description: http://www.literature.molex.com/SQLImages/kelmscott/Molex/PDF_Images/987651-4081.PDF?src-supplier=Avnet+Asia; Supplier Part Number 1: WM12856CT-ND
R40-R46 R49-R53 = RC0402FR-1310KL: RES SMD 10K OHM 1% 0402 1/16W Chip Resistor, 0402 [1005 Metric], 10 kohm, RC Series, 50 V, Thick Film, 62.5 mW; Manufacturer 1: Yageo; Resistance: 10kR; Temperature Coefficient: 100ppm/°C; Power Rating: 62.5mW; Voltage Rating: 50V; ComponentLink1URL: https://datasheet.ciiva.com/16940/pyu-rc0402-51-rohs-l-6-16940293.pdf?src-supplier=Avnet+Europe; ComponentLink1Description: https://datasheet.ciiva.com/16940/pyu-rc0402-51-rohs-l-6-16940293.pdf?src-supplier=Avnet+Europe; ComponentLink2URL: https://datasheet.ciiva.com/28386/pyu-rc0402-51-rohs-l-6-28386855.pdf?src-supplier=Avnet+Europe; ComponentLink2Description: https://datasheet.ciiva.com/28386/pyu-rc0402-51-rohs-l-6-28386855.pdf?src-supplier=Avnet+Europe; ComponentLink3URL: https://datasheet.ciiva.com/16740/pyu-rc0402-51-rohs-l-6-r-16740602.pdf?src-supplier=Future+Electronics; ComponentLink3Description: https://datasheet.ciiva.com/16740/pyu-rc0402-51-rohs-l-6-r-16740602.pdf?src-supplier=Future+Electronics; ComponentLink4URL: https://datasheet.ciiva.com/8891/pyu-rc0402-51-rohs-l-6-8891339.pdf?src-supplier=Avnet; ComponentLink4Description: https://datasheet.ciiva.com/8891/pyu-rc0402-51-rohs-l-6-8891339.pdf?src-supplier=Avnet; ComponentLink5URL: https://datasheet.ciiva.com/5557/pyu-rc0402-51-rohs-l-6-r-5557997.pdf?src-supplier=Mouser; ComponentLink5Description: https://datasheet.ciiva.com/5557/pyu-rc0402-51-rohs-l-6-r-5557997.pdf?src-supplier=Mouser; ComponentLink6URL: https://datasheet.ciiva.com/7983/1018594-7983533.pdf?src-supplier=Element14; ComponentLink6Description: https://datasheet.ciiva.com/7983/1018594-7983533.pdf?src-supplier=Element14; Supplier 1: Newark; Manufacturer Part Number 1: RC0402FR-1310KL; Stock 1: 62239; Pricing 1: 1=0.10000, 25=0.01200, 100=0.00400, 250=0.00400, 500=0.00300, 1000=0.00300 (USD); RoHS: Yes; Case/Package: 0402; Number of Pins: 2; Contact Plating: Tin,Matte,Lead; Case Code (Imperial): 0402; Case Code (Metric): 1005; Min Operating Temperature: -55°C; Max Operating Temperature: 155°C; Tolerance: 1%; Composition: Thick Film; Packaging: Tape and Reel; Termination: SMD/SMT; Military Standard: Not; Voltage Rating (DC): 50V; Working Voltage: 50V; Number of Terminations: 2; Length: 1mm; Depth: 0.5mm; Radiation Hardening: No; REACH SVHC: No SVHC; Lead Free: Lead Free; Supplier Part Number 1: 67R9960
  R53: Supplier 2: Future Electronics; Supplier 3: Mouser; Supplier 4: Element14; Supplier Part Number 2: RC0402FR-1310KL-CUTT; Supplier Part Number 3: 603-RC0402FR-1310KL; Supplier Part Number 4: 1799235
R47 R48 = CRCW04021M80FKED: RES SMD 1.8M OHM 1% 1/16W 0402; Manufacturer 1: Vishay; Voltage Rating: 50V; Temperature Coefficient: 100ppm/°C; Power Rating: 63mW; Supplier 1: Digi-Key; Manufacturer Part Number 1: CRCW04021M80FKED; Stock 1: 26061; Pricing 1: 1=0.10000, 10=0.03800, 100=0.01540, 1000=0.00690, 2500=0.00599, 5000=0.00495 (USD); RoHS: Yes; Mount: Surface Mount; Case/Package: 0402; Number of Pins: 2; Weight: 2.3E-05oz; Case Code (Imperial): 0402; Case Code (Metric): 1005; Contact Plating: Tin; Min Operating Temperature: -55°C; Max Operating Temperature: 155°C; Packaging: Tape and Reel; Package Quantity: 10000; Termination: SMD/SMT; Voltage Rating (DC): 50V; Composition: Thick Film; Tolerance: 1%; Military Standard: Not; Resistance: 1.8MR; Length: 1mm; Height: 0.35mm; Width: 0.5mm; Depth: 0.5mm; Radiation Hardening: No; Lead Free: Lead Free; REACH SVHC: Unknown; ComponentLink1URL: https://datasheet.ciiva.com/11812/0900766b80d98824-11812579.pdf?src-supplier=RSComponents; ComponentLink1Description: https://datasheet.ciiva.com/11812/0900766b80d98824-11812579.pdf?src-supplier=RSComponents; ComponentLink2URL: https://datasheet.ciiva.com/16886/dcrcwe3-16886536.pdf?src-supplier=Avnet+Europe; ComponentLink2Description: https://datasheet.ciiva.com/16886/dcrcwe3-16886536.pdf?src-supplier=Avnet+Europe; ComponentLink3URL: https://datasheet.ciiva.com/7800/1697337-7800987.pdf?src-supplier=Element14; ComponentLink3Description: https://datasheet.ciiva.com/7800/1697337-7800987.pdf?src-supplier=Element14; ComponentLink4URL: https://datasheet.ciiva.com/16786/70201119-16786875.pdf?src-supplier=Allied+Electronics; ComponentLink4Description: https://datasheet.ciiva.com/16786/70201119-16786875.pdf?src-supplier=Allied+Electronics; ComponentLink5URL: https://datasheet.ciiva.com/22676/1700796-22676027.pdf?src-supplier=Element14; ComponentLink5Description: https://datasheet.ciiva.com/22676/1700796-22676027.pdf?src-supplier=Element14; ComponentLink6URL: https://datasheet.ciiva.com/7800/1697337-7800988.pdf?src-supplier=Element14; ComponentLink6Description: https://datasheet.ciiva.com/7800/1697337-7800988.pdf?src-supplier=Element14; ComponentLink7URL: https://datasheet.ciiva.com/26316/fld-crcw-e3-data-en-26316605.pdf?src-supplier=Distrelec; ComponentLink7Description: https://datasheet.ciiva.com/26316/fld-crcw-e3-data-en-26316605.pdf?src-supplier=Distrelec; ComponentLink8URL: https://datasheet.ciiva.com/8336/dcrcwe3-8336646.pdf?src-supplier=Avnet; ComponentLink8Description: https://datasheet.ciiva.com/8336/dcrcwe3-8336646.pdf?src-supplier=Avnet; Supplier Part Number 1: 541-1.80MLCT-ND
TP22 = TEST_POINT
U8 = CBTL02043A: Multiplexer And Demux/Decoder, CBT/FST/QS/5C/B Series, 1-Func, 2 Line Input, 1 Line Output, True Output, PQCC20; Manufacturer 1: NXP Semiconductors; Manufacturer Part Number 1: CBTL02043ABQ,115; Supplier 1: Digi-Key; RoHS: Yes; Category: Interface ICs; Stock 1: 19938; Pricing 1: 1=1,77000, 10=1,63000 (USD); ComponentLink1URL: https://datasheet.ciiva.com:443/pdfs/VipMasterIC/IC/PHGL/PHGL-S-A0000727649/PHGL-S-A0000727649-1.pdf?src-supplier=IHS+Markit; ComponentLink1Description: https://datasheet.ciiva.com:443/pdfs/VipMasterIC/IC/PHGL/PHGL-S-A0000727649/PHGL-S-A0000727649-1.pdf?src-supplier=IHS+Markit; ComponentLink2URL: https://datasheet.ciiva.com/4921/cbtl02043a-cbtl02043b-87520-4921245.pdf?src-supplier=Mouser; ComponentLink2Description: https://datasheet.ciiva.com/4921/cbtl02043a-cbtl02043b-87520-4921245.pdf?src-supplier=Mouser; ComponentLink3URL: https://datasheet.ciiva.com/6637/cbtl02043a-cbtl02043b-6637066.pdf?src-supplier=Digi-Key; ComponentLink3Description: https://datasheet.ciiva.com/6637/cbtl02043a-cbtl02043b-6637066.pdf?src-supplier=Digi-Key; Supplier Part Number 1: 568-6678-1-ND
U9 = TUSB321RWBR: IC USB PORT CONTROL TYPE-C 12X2Q; Manufacturer 1: Texas Instruments; Min Supply Voltage: 4.5V; Max Supply Voltage: 5.5V; Number of Ports: 1; USB Standard: USB 3.1; Supplier 1: Digi-Key; Manufacturer Part Number 1: TUSB321RWBR; Stock 1: 7746; Pricing 1: 1=2.27000, 10=2.04200, 100=1.64100, 500=1.34828, 1000=1.11714 (USD); RoHS: Yes; Mount: Surface Mount; Number of Pins: 12; Contact Plating: Gold; Min Operating Temperature: 0°C; Max Operating Temperature: 70°C; Packaging: Tape and Reel; REACH SVHC: No SVHC; Lead Free: Lead Free; ComponentLink1URL: http://www.ti.com/general/docs/lit/getliterature.tsp?genericPartNumber=TUSB321&&fileType=pdf&src-supplier=Avnet+Asia; ComponentLink1Description: http://www.ti.com/general/docs/lit/getliterature.tsp?genericPartNumber=TUSB321&&fileType=pdf&src-supplier=Avnet+Asia; ComponentLink2URL: http://www.ti.com/general/docs/lit/getliterature.tsp?genericPartNumber=TUSB321&&fileType=pdf&src-supplier=Farnell; ComponentLink2Description: http://www.ti.com/general/docs/lit/getliterature.tsp?genericPartNumber=TUSB321&&fileType=pdf&src-supplier=Farnell; ComponentLink3URL: http://www.ti.com/lit/ds/symlink/tusb321.pdf?src-supplier=Digi-Key; ComponentLink3Description: http://www.ti.com/lit/ds/symlink/tusb321.pdf?src-supplier=Digi-Key; ComponentLink4URL: http://www.ti.com/general/docs/lit/getliterature.tsp?genericPartNumber=TUSB321&&fileType=pdf&src-supplier=Element14; ComponentLink4Description: http://www.ti.com/general/docs/lit/getliterature.tsp?genericPartNumber=TUSB321&&fileType=pdf&src-supplier=Element14; ComponentLink5URL: http://www.ti.com/general/docs/lit/getliterature.tsp?genericPartNumber=TUSB321&&fileType=pdf&src-supplier=Avnet; ComponentLink5Description: http://www.ti.com/general/docs/lit/getliterature.tsp?genericPartNumber=TUSB321&&fileType=pdf&src-supplier=Avnet; Supplier Part Number 1: 296-42400-1-ND
U10 = TXS0102DCUR: TEXAS INSTRUMENTS - TXS0102DCUR - IC, TRANSLATOR, 2 BIT, BI, US-8; Min Supply Voltage: 1.65V; Max Supply Voltage: 5.5V; Data Rate: 24Mbps; Number of Channels: 2; Propagation Delay: 4.6ns; Turn-On Delay Time: 260ns; High Level Output Current: -20uA; Low Level Output Current: 1mA; Quiescent Current: 14.4uA; Output Type: Voltage; Output Current: 1A; Supplier 1: Digi-Key; Manufacturer 1: Texas Instruments; Manufacturer Part Number 1: TXS0102DCUR; RoHS: Yes; Category: Logic Gates; Stock 1: 55123; Pricing 1: 1=0.75000, 10=0.65900, 25=0.61960, 100=0.50550, 250=0.46956, 500=0.39964, 1000=0.31971 (USD); Case/Package: VSSOP; Number of Pins: 8; Weight: 0.000339oz; Min Operating Temperature: -40°C; Max Operating Temperature: 85°C; Package Quantity: 1; Packaging: Tape and Reel; Logic Function: Translator; Number of Bits: 2; Number of Inputs: 2; Nominal Supply Current: 14.4uA; Radiation Hardening: No; Lead Free: Lead Free; REACH SVHC: No SVHC; ComponentLink1URL: https://datasheet.ciiva.com/15096/getdatasheetpartid-118249-15096172.pdf?src-supplier=Verical; ComponentLink1Description: https://datasheet.ciiva.com/15096/getdatasheetpartid-118249-15096172.pdf?src-supplier=Verical; ComponentLink2URL: https://datasheet.ciiva.com/22653/1846850-22653373.pdf?src-supplier=Farnell; ComponentLink2Description: https://datasheet.ciiva.com/22653/1846850-22653373.pdf?src-supplier=Farnell; ComponentLink3URL: https://datasheet.ciiva.com/1508/1857232-1508821.pdf?src-supplier=Element14; ComponentLink3Description: https://datasheet.ciiva.com/1508/1857232-1508821.pdf?src-supplier=Element14; ComponentLink4URL: https://datasheet.ciiva.com/1899/txs0102-1899368.pdf?src-supplier=Digi-Key; ComponentLink4Description: https://datasheet.ciiva.com/1899/txs0102-1899368.pdf?src-supplier=Digi-Key; ComponentLink5URL: https://datasheet.ciiva.com/1899/txs0102-1899369.pdf?src-supplier=Digi-Key; ComponentLink5Description: https://datasheet.ciiva.com/1899/txs0102-1899369.pdf?src-supplier=Digi-Key; ComponentLink6URL: https://datasheet.ciiva.com/1899/txs0102-1899370.pdf?src-supplier=Digi-Key; ComponentLink6Description: https://datasheet.ciiva.com/1899/txs0102-1899370.pdf?src-supplier=Digi-Key; ComponentLink7URL: https://datasheet.ciiva.com/14287/txs0102-14287516.pdf?src-supplier=Avnet; ComponentLink7Description: https://datasheet.ciiva.com/14287/txs0102-14287516.pdf?src-supplier=Avnet; ComponentLink8URL: https://datasheet.ciiva.com/28499/1863639-28499676.pdf?src-supplier=Element14; ComponentLink8Description: https://datasheet.ciiva.com/28499/1863639-28499676.pdf?src-supplier=Element14; ComponentLink9URL: https://datasheet.ciiva.com/14287/txs0102-14287518.pdf?src-supplier=Avnet; ComponentLink9Description: https://datasheet.ciiva.com/14287/txs0102-14287518.pdf?src-supplier=Avnet; ComponentLink10URL: https://datasheet.ciiva.com/46395/1863639-46395871.pdf?src-supplier=Element14; ComponentLink10Description: https://datasheet.ciiva.com/46395/1863639-46395871.pdf?src-supplier=Element14; Supplier 2: Newark; Supplier 3: Mouser; Supplier Part Number 1: 296-21931-1-ND; Supplier Part Number 2: 30M1878; Supplier Part Number 3: 595-TXS0102DCUR

## Sheet Project_Information.SchDoc: =project_title
size Tabloid; CompanyName: Luxonis Holding; DrawnBy: David Malovrh; Organization: Luxonis Holding; Address1: 1925 Harmony Park Drive; Address2: Westminster, CO; Address3: 80234; Address4: United States; DocumentNumber: D0000190; SheetNumber: 2; SheetTotal: 12
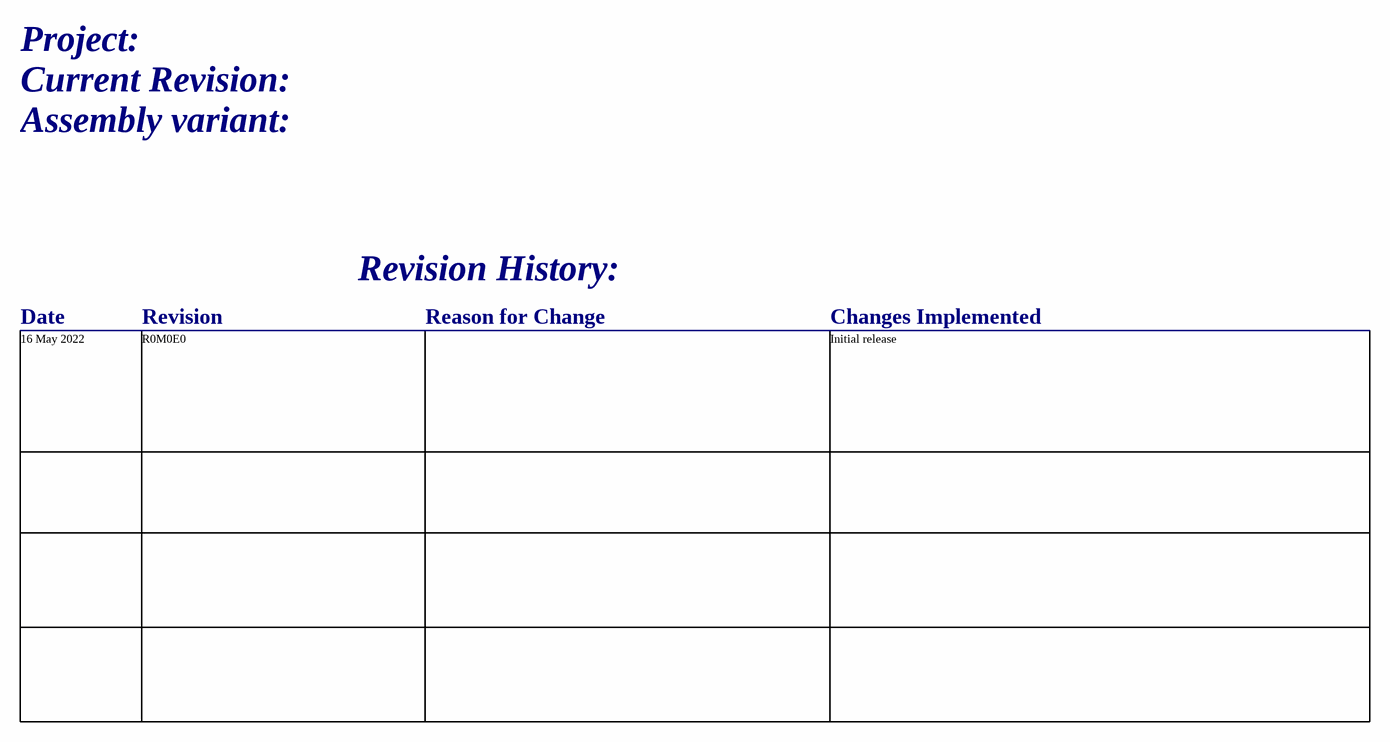
[diagram p2: Project_Information.SchDoc]

### Notes on the sheet
- Project:
- Current Revision:
- Assembly variant:
- Revision History:
- Date
- Revision
- Reason for Change
- Changes Implemented
- 16 May 2022
- R0M0E0
- Initial release
- Title
- Size:
- Date:
- Tabloid
- Number:
- Time:
- Revision:
- Sheet
- of
- Drawn by: